# Altium schematic sheet Sheet1.SchDoc
size 594 x 420 mm; SheetNumber: 1; SheetTotal: 1
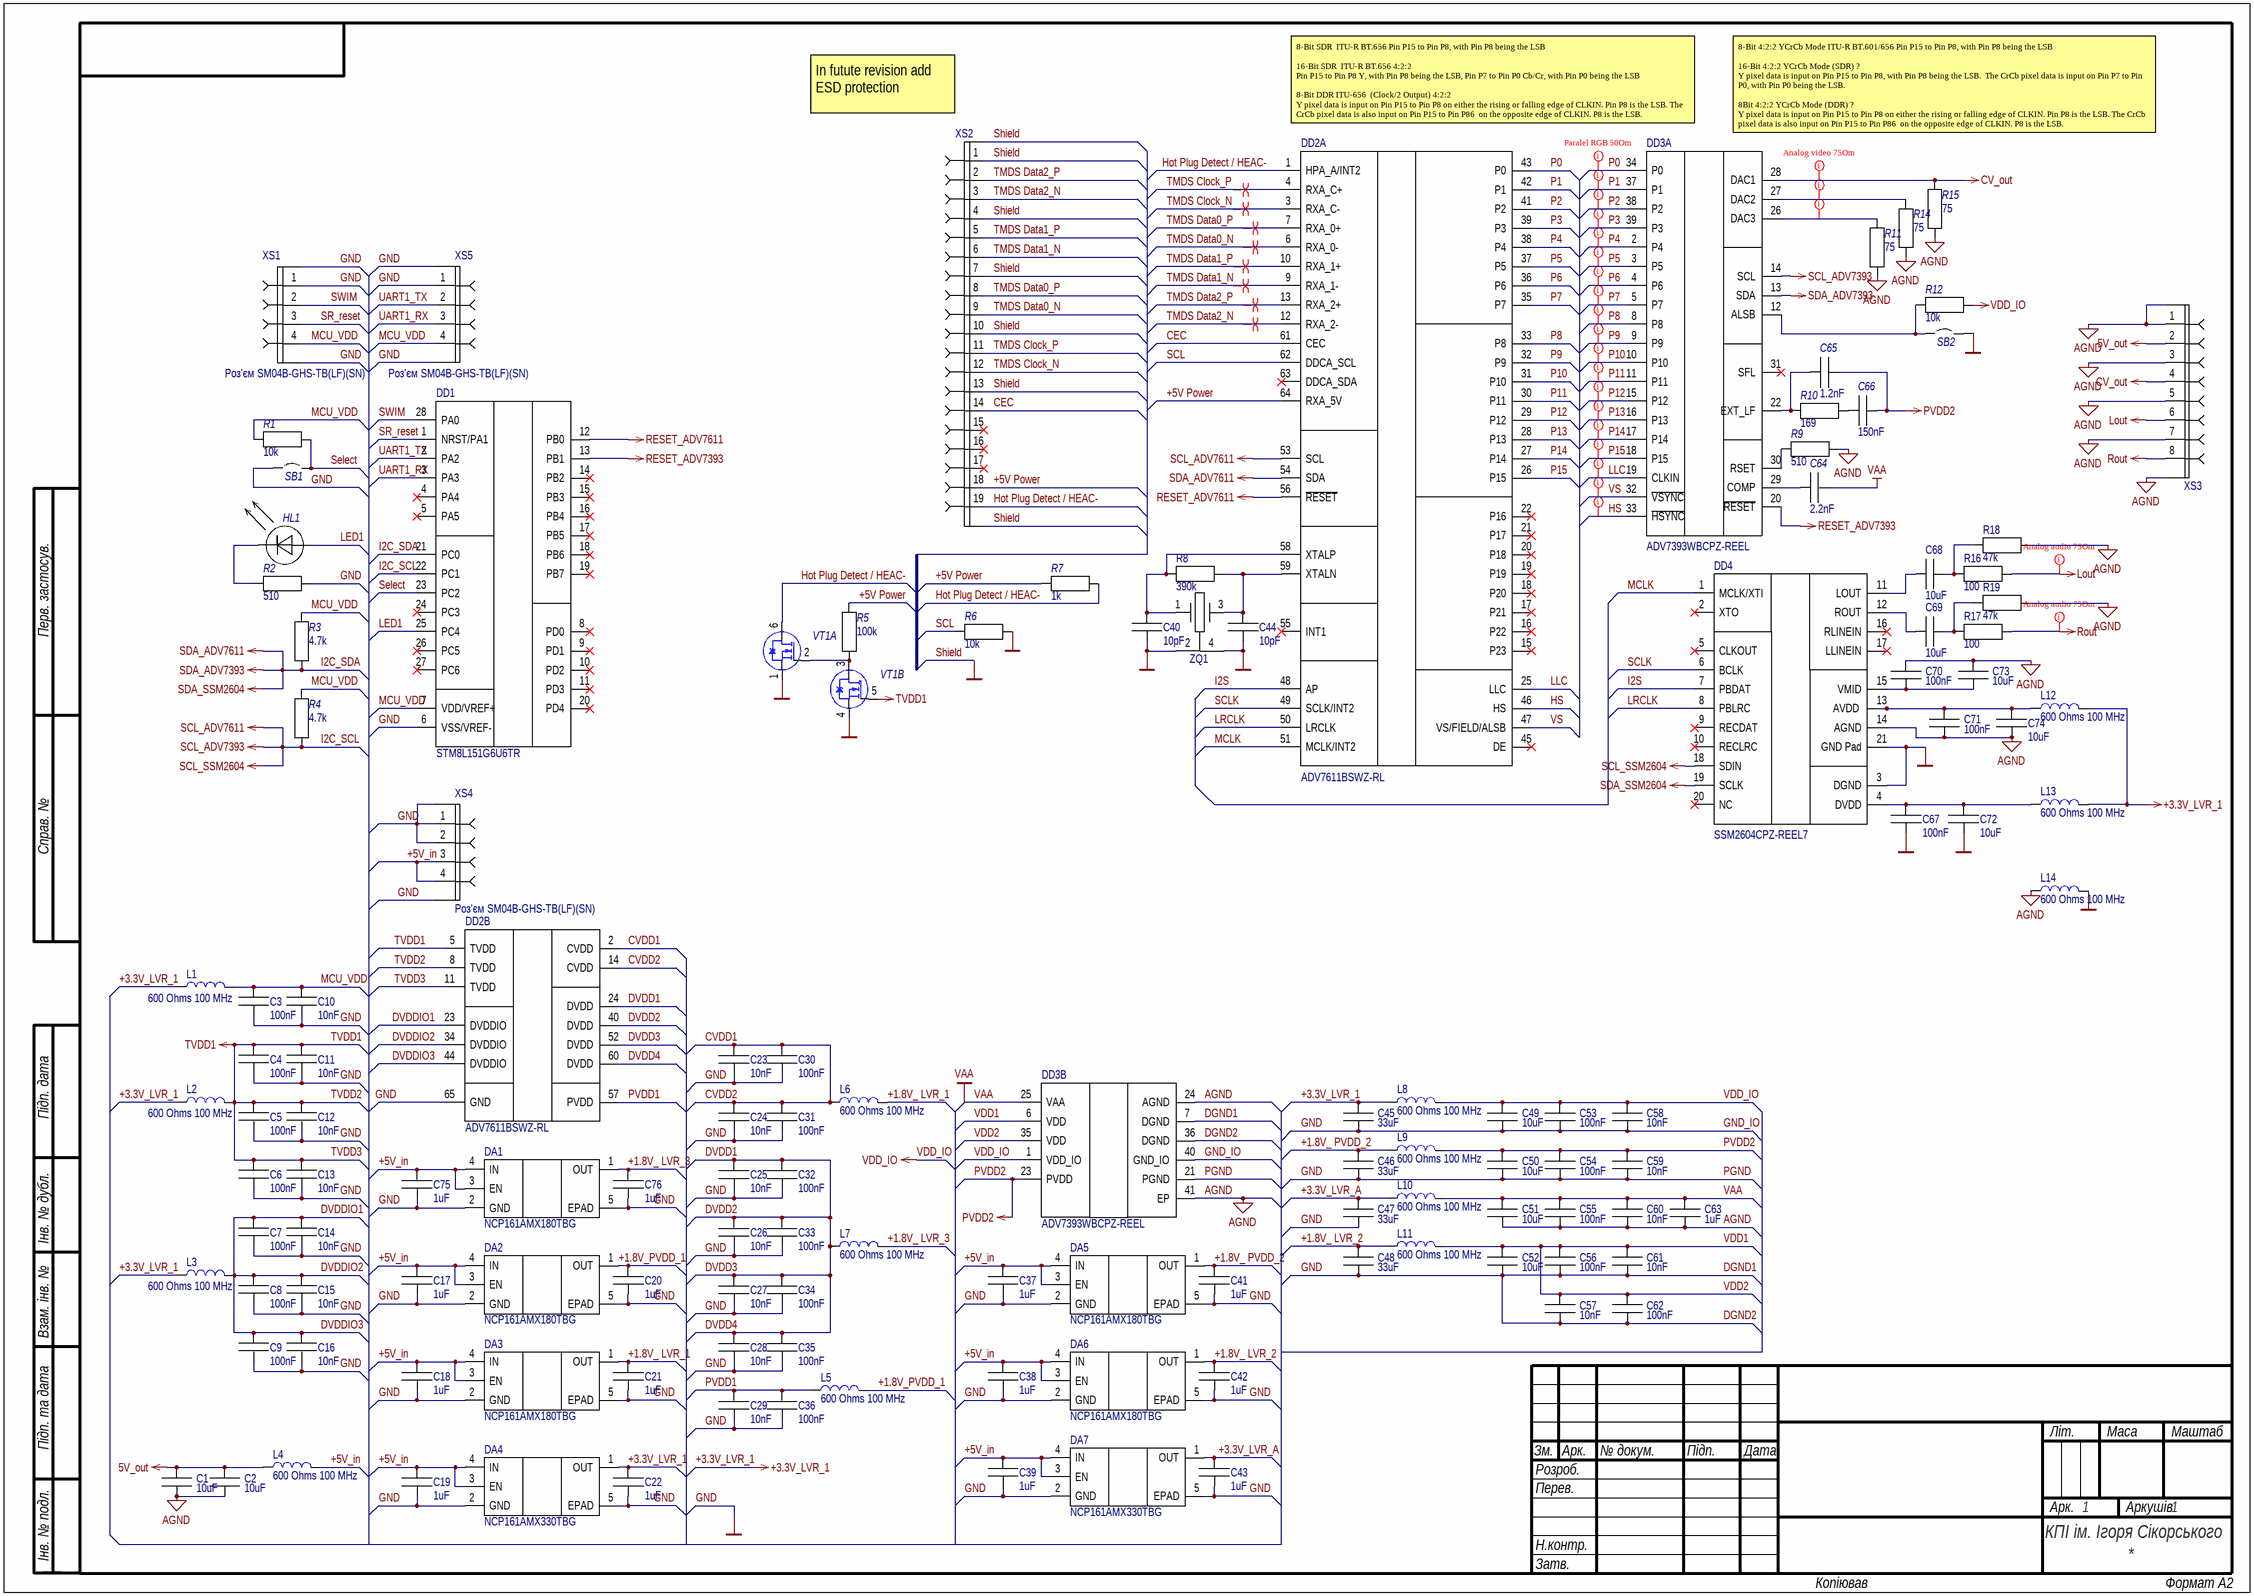
[diagram p0: Sheet1.SchDoc]

## Parts
C1  value 10uF  [SC0603_L]  (hidden comment: CL10A106MQ8NNNC)
C2  value 10uF  [SC0603_L]  (hidden comment: CL10A106MQ8NNNC)
C3  value 100nF  [FP-C0402-BB-IPC_A]  (hidden comment: C0402C104K4RAC7867)
C4  value 100nF  [FP-C0402-BB-IPC_A]  (hidden comment: C0402C104K4RAC7867)
C5  value 100nF  [FP-C0402-BB-IPC_A]  (hidden comment: C0402C104K4RAC7867)
C6  value 100nF  [FP-C0402-BB-IPC_A]  (hidden comment: C0402C104K4RAC7867)
C7  value 100nF  [FP-C0402-BB-IPC_A]  (hidden comment: C0402C104K4RAC7867)
C8  value 100nF  [FP-C0402-BB-IPC_A]  (hidden comment: C0402C104K4RAC7867)
C9  value 100nF  [FP-C0402-BB-IPC_A]  (hidden comment: C0402C104K4RAC7867)
C10  value 10nF  [FP-C0402-BB-IPC_A]  (hidden comment: C0402C103K4RAC7867)
C11  value 10nF  [FP-C0402-BB-IPC_A]  (hidden comment: C0402C103K4RAC7867)
C12  value 10nF  [FP-C0402-BB-IPC_A]  (hidden comment: C0402C103K4RAC7867)
C13  value 10nF  [FP-C0402-BB-IPC_A]  (hidden comment: C0402C103K4RAC7867)
C14  value 10nF  [FP-C0402-BB-IPC_A]  (hidden comment: C0402C103K4RAC7867)
C15  value 10nF  [FP-C0402-BB-IPC_A]  (hidden comment: C0402C103K4RAC7867)
C16  value 10nF  [FP-C0402-BB-IPC_A]  (hidden comment: C0402C103K4RAC7867)
C17  value 1uF  [SC0603_L]  (hidden comment: CC0603KRX5R8BB105)
C18  value 1uF  [SC0603_L]  (hidden comment: CC0603KRX5R8BB105)
C19  value 1uF  [SC0603_L]  (hidden comment: CC0603KRX5R8BB105)
C20  value 1uF  [SC0603_L]  (hidden comment: CC0603KRX5R8BB105)
C21  value 1uF  [SC0603_L]  (hidden comment: CC0603KRX5R8BB105)
C22  value 1uF  [SC0603_L]  (hidden comment: CC0603KRX5R8BB105)
C23  value 10nF  [FP-C0402-BB-IPC_A]  (hidden comment: C0402C103K4RAC7867)
C24  value 10nF  [FP-C0402-BB-IPC_A]  (hidden comment: C0402C103K4RAC7867)
C25  value 10nF  [FP-C0402-BB-IPC_A]  (hidden comment: C0402C103K4RAC7867)
C26  value 10nF  [FP-C0402-BB-IPC_A]  (hidden comment: C0402C103K4RAC7867)
C27  value 10nF  [FP-C0402-BB-IPC_A]  (hidden comment: C0402C103K4RAC7867)
C28  value 10nF  [FP-C0402-BB-IPC_A]  (hidden comment: C0402C103K4RAC7867)
C29  value 10nF  [FP-C0402-BB-IPC_A]  (hidden comment: C0402C103K4RAC7867)
C30  value 100nF  [FP-C0402-BB-IPC_A]  (hidden comment: C0402C104K4RAC7867)
C31  value 100nF  [FP-C0402-BB-IPC_A]  (hidden comment: C0402C104K4RAC7867)
C32  value 100nF  [FP-C0402-BB-IPC_A]  (hidden comment: C0402C104K4RAC7867)
C33  value 100nF  [FP-C0402-BB-IPC_A]  (hidden comment: C0402C104K4RAC7867)
C34  value 100nF  [FP-C0402-BB-IPC_A]  (hidden comment: C0402C104K4RAC7867)
C35  value 100nF  [FP-C0402-BB-IPC_A]  (hidden comment: C0402C104K4RAC7867)
C36  value 100nF  [FP-C0402-BB-IPC_A]  (hidden comment: C0402C104K4RAC7867)
C37  value 1uF  [SC0603_L]  (hidden comment: CC0603KRX5R8BB105)
C38  value 1uF  [SC0603_L]  (hidden comment: CC0603KRX5R8BB105)
C39  value 1uF  [SC0603_L]  (hidden comment: CC0603KRX5R8BB105)
C40  value 10pF  [SC0603_L]  (hidden comment: C0603-10pF-16V-C0603C100F4HAC7867)
C41  value 1uF  [SC0603_L]  (hidden comment: CC0603KRX5R8BB105)
C42  value 1uF  [SC0603_L]  (hidden comment: CC0603KRX5R8BB105)
C43  value 1uF  [SC0603_L]  (hidden comment: CC0603KRX5R8BB105)
C44  value 10pF  [SC0603_L]  (hidden comment: C0603-10pF-16V-C0603C100F4HAC7867)
C45  value 33uF  [1206]  (hidden comment: C3216X5R1E336M160AC)
C46  value 33uF  [1206]  (hidden comment: C3216X5R1E336M160AC)
C47  value 33uF  [1206]  (hidden comment: C3216X5R1E336M160AC)
C48  value 33uF  [1206]  (hidden comment: C3216X5R1E336M160AC)
C49  value 10uF  [SC0603_L]  (hidden comment: CL10A106MQ8NNNC)
C50  value 10uF  [SC0603_L]  (hidden comment: CL10A106MQ8NNNC)
C51  value 10uF  [SC0603_L]  (hidden comment: CL10A106MQ8NNNC)
C52  value 10uF  [SC0603_L]  (hidden comment: CL10A106MQ8NNNC)
C53  value 100nF  [FP-C0402-BB-IPC_A]  (hidden comment: C0402C104K4RAC7867)
C54  value 100nF  [FP-C0402-BB-IPC_A]  (hidden comment: C0402C104K4RAC7867)
C55  value 100nF  [FP-C0402-BB-IPC_A]  (hidden comment: C0402C104K4RAC7867)
C56  value 100nF  [FP-C0402-BB-IPC_A]  (hidden comment: C0402C104K4RAC7867)
C57  value 10nF  [FP-C0402-BB-IPC_A]  (hidden comment: C0402C103K4RAC7867)
C58  value 10nF  [FP-C0402-BB-IPC_A]  (hidden comment: C0402C103K4RAC7867)
C59  value 10nF  [FP-C0402-BB-IPC_A]  (hidden comment: C0402C103K4RAC7867)
C60  value 10nF  [FP-C0402-BB-IPC_A]  (hidden comment: C0402C103K4RAC7867)
C61  value 10nF  [FP-C0402-BB-IPC_A]  (hidden comment: C0402C103K4RAC7867)
C62  value 100nF  [FP-C0402-BB-IPC_A]  (hidden comment: C0402C104K4RAC7867)
C63  value 1uF  [SC0603_L]  (hidden comment: CC0603KRX5R8BB105)
C64  value 2.2nF  [FP-C0402-BB-IPC_A]  (hidden comment: C0402C222K3RAC7867)
C65  value 1.2nF  [FP-C0402-BB-IPC_A]  (hidden comment: C0402C222K3RAC7867)
C66  value 150nF  [FP-C0402-BB-IPC_A]  (hidden comment: CGA2B1X7R1V154K050BC)
C67  value 100nF  [FP-C0402-BB-IPC_A]  (hidden comment: C0402C104K4RAC7867)
C68  value 10uF  [SC0603_L]  (hidden comment: CL10A106MQ8NNNC)
C69  value 10uF  [SC0603_L]  (hidden comment: CL10A106MQ8NNNC)
C70  value 100nF  [FP-C0402-BB-IPC_A]  (hidden comment: C0402C104K4RAC7867)
C71  value 100nF  [FP-C0402-BB-IPC_A]  (hidden comment: C0402C104K4RAC7867)
C72  value 10uF  [SC0603_L]  (hidden comment: CL10A106MQ8NNNC)
C73  value 10uF  [SC0603_L]  (hidden comment: CL10A106MQ8NNNC)
C74  value 10uF  [SC0603_L]  (hidden comment: CL10A106MQ8NNNC)
C75  value 1uF  [SC0603_L]  (hidden comment: CC0603KRX5R8BB105)
C76  value 1uF  [SC0603_L]  (hidden comment: CC0603KRX5R8BB105)
DA1  NCP161AMX180TBG  [XDFN4_711AJ_ONS_OSI]
DA2  NCP161AMX180TBG  [XDFN4_711AJ_ONS_OSI]
DA3  NCP161AMX180TBG  [XDFN4_711AJ_ONS_OSI]
DA4  NCP161AMX330TBG  [XDFN4_711AJ_ONS_OSI]
DA5  NCP161AMX180TBG  [XDFN4_711AJ_ONS_OSI]
DA6  NCP161AMX180TBG  [XDFN4_711AJ_ONS_OSI]
DA7  NCP161AMX330TBG  [XDFN4_711AJ_ONS_OSI]
DD1  STM8L151G6U6TR  [UFQFPN28-4x4mm]
DD2  ADV7611BSWZ-RL  [ADI-SW-64-2_N]  (parts A,B of 2)
DD3  ADV7393WBCPZ-REEL  [ADI-CP-40-1_N]  (parts A,B of 2)
DD4  SSM2604CPZ-REEL7  [CP_20_4_ADI]
HL1  LTST-C170GKT  [LED_0805_G]  (value not drawn)
L1  value 600 Ohms 100 MHz  [SC0603_L]  (hidden comment: ferrite bead)
L2  value 600 Ohms 100 MHz  [SC0603_L]  (hidden comment: ferrite bead)
L3  value 600 Ohms 100 MHz  [SC0603_L]  (hidden comment: ferrite bead)
L4  value 600 Ohms 100 MHz  [SC0603_L]  (hidden comment: ferrite bead)
L5  value 600 Ohms 100 MHz  [SC0603_L]  (hidden comment: ferrite bead)
L6  value 600 Ohms 100 MHz  [SC0603_L]  (hidden comment: ferrite bead)
L7  value 600 Ohms 100 MHz  [SC0603_L]  (hidden comment: ferrite bead)
L8  value 600 Ohms 100 MHz  [SC0603_L]  (hidden comment: ferrite bead)
L9  value 600 Ohms 100 MHz  [SC0603_L]  (hidden comment: ferrite bead)
L10  value 600 Ohms 100 MHz  [SC0603_L]  (hidden comment: ferrite bead)
L11  value 600 Ohms 100 MHz  [SC0603_L]  (hidden comment: ferrite bead)
L12  value 600 Ohms 100 MHz  [SC0603_L]  (hidden comment: ferrite bead)
L13  value 600 Ohms 100 MHz  [SC0603_L]  (hidden comment: ferrite bead)
L14  value 600 Ohms 100 MHz  [SC0603_L]  (hidden comment: ferrite bead)
R1  value 10k  [RC04025-L]  (hidden comment: ERJ-2RKF1002X)
R2  value 510  [RC04025-L]  (hidden comment: ERJ-2RKF5100X)
R3  value 4.7k  [RC04025-L]  (hidden comment: ERJ-2RKF4701X)
R4  value 4.7k  [RC04025-L]  (hidden comment: ERJ-2RKF4701X)
R5  value 100k  [RC04025-L]  (hidden comment: ERJ-2RKF1003X)
R6  value 10k  [RC04025-L]  (hidden comment: ERJ-2RKF1002X)
R7  value 1k  [RC04025-L]  (hidden comment: ERJ-2RKF1001X)
R8  value 390k  [RC04025-L]  (hidden comment: RK73H1ETTP3903F)
R9  value 510  [RC04025-L]  (hidden comment: ERJ-2RKF5100X)
R10  value 169  [RC04025-L]  (hidden comment: ERJ-2RKF1690X)
R11  value 75  [RC04025-L]  (hidden comment: ERJ-2GEJ750X)
R12  value 10k  [RC04025-L]  (hidden comment: ERJ-2RKF1002X)
R14  value 75  [RC04025-L]  (hidden comment: ERJ-2GEJ750X)
R15  value 75  [RC04025-L]  (hidden comment: ERJ-2GEJ750X)
R16  value 100  [RC04025-L]  (hidden comment: ERJ-2RKF1000X)
R17  value 100  [RC04025-L]  (hidden comment: ERJ-2RKF1000X)
R18  value 47k  [RC04025-L]  (hidden comment: ERJ-2RKF4702X)
R19  value 47k  [RC04025-L]  (hidden comment: ERJ-2RKF4702X)
SB1  Jumper SB  [SB0603]  (value not drawn)  (no BOM)
SB2  Jumper SB  [SB0603]  (value not drawn)  (no BOM)
VT1  FDY3000NZ  [FAIR-SOT-563F-6-A_V]  (value not drawn)  (parts A,B of 2)
XS1  Назва за КД: Роз'єм SM04B-GHS-TB(LF)(SN)  [SM04B-GHS-TB]  (hidden comment: SM04B-GHS-TB)
XS2  685119136923  [685119136923]  (value not drawn)
XS3  SM08B-GHS-TB  [SM08B-GHS-TB]  (value not drawn)
XS4  Назва за КД: Роз'єм SM04B-GHS-TB(LF)(SN)  [SM04B-GHS-TB]  (hidden comment: SM04B-GHS-TB)
XS5  Назва за КД: Роз'єм SM04B-GHS-TB(LF)(SN)  [SM04B-GHS-TB]  (hidden comment: SM04B-GHS-TB)
ZQ1  ABM11-28.63636MHZ-D2X-T3  [FP-ABM11-MFG]  (value not drawn)

## Nets
5V_out: C1.2 C2.2 L4.1 XS3.2
+3.3V_LVR_1: C22.2 C45.2 DA4.1(OUT) L1.1 L2.1 L3.1 L8.1 L12.2 L13.2
AGND: C1.1 C2.1 C51.1 C55.1 C60.1 C63.1 C70.2 C71.1 C73.2 C74.1 DD3.24(AGND) DD3.41(EP) DD4.14(AGND) L14.1 R9.2 R11.1 R14.1 R15.1 R18.1 R19.1 XS3.1 XS3.3 XS3.5 XS3.7 XS3.M
CV_out: DD3.28(DAC1) R15.2 XS3.4
DGND1: C3.1 C4.1 C5.1 C6.1 C7.1 C8.1 C9.1 C10.1 C11.1 C12.1 C13.1 C14.1 C15.1 C16.1 C17.1 C18.1 C19.1 C20.1 C21.1 C22.1 C23.1 C24.1 C25.1 C26.1 C27.1 C28.1 C29.1 C30.1 C31.1 C32.1 C33.1 C34.1 C35.1 C36.1 C37.1 C38.1 C39.1 C40.1 C41.1 C42.1 C43.1 C44.1 C45.1 C46.1 C47.1 C48.1 C49.1 C50.1 C52.1 C53.1 C54.1 C56.1 C57.1 C58.1 C59.1 C61.1 C62.1 C67.1 C72.1 C75.1 C76.1 DA1.2(GND) DA1.5(EPAD) DA2.2(GND) DA2.5(EPAD) DA3.2(GND) DA3.5(EPAD) DA4.2(GND) DA4.5(EPAD) DA5.2(GND) DA5.5(EPAD) DA6.2(GND) DA6.5(EPAD) DA7.2(GND) DA7.5(EPAD) DD1.6(VSS/VREF-) DD2.65(GND) DD3.7(DGND) DD3.21(PGND) DD3.36(DGND) DD3.40(GND_IO) DD4.3(DGND) DD4.21(GND_Pad) L14.2 R2.2 R6.1 SB1.1 SB2.1 VT1.1(S1) VT1.4(S2) XS1.1 XS1.M XS2.1(TMDS_Data2_Shield) XS2.4(TMDS_Data1_Shield) XS2.7(TMDS_Data0_Shield) XS2.10(TMDS_Clock_Shield) XS2.13(DDC_/_CEC_Ground_/_HEAC_Shield) XS2.Shell(Shield) XS4.1 XS4.2 XS4.M XS5.1 XS5.M ZQ1.2(GND) ZQ1.4(GND)  [also labelled DGND2, GND, GND_IO, PGND, Shield]
I2C_SCL: DD1.22(PC1) DD2.53(SCL) DD3.14(SCL) DD4.18(SDIN) R4.1  [also labelled SCL_ADV7393, SCL_ADV7611, SCL_SSM2604]
I2C_SDA: DD1.21(PC0) DD2.54(SDA) DD3.13(SDA) DD4.19(SCLK) R3.1  [also labelled SDA_ADV7393, SDA_ADV7611, SDA_SSM2604]
Lout: R16.2 XS3.6
PVDD2: C50.2 C54.2 C59.2 C65.2 C66.2 DD3.23(PVDD) L9.2
RESET_ADV7393: DD1.13(PB1) DD3.20(~{RESET})
RESET_ADV7611: DD1.12(PB0) DD2.56(~{RESET})
Rout: R17.2 XS3.8
TVDD1: C4.2 C5.2 C6.2 C11.2 C12.2 C13.2 DD2.5(TVDD) DD2.8(TVDD) DD2.11(TVDD) L2.2 VT1.5(G2)  [also labelled TVDD2, TVDD3]
VAA: C51.2 C55.2 C60.2 C63.2 C64.1 DD3.25(VAA) L10.2
VDD_IO: C49.2 C53.2 C58.2 DD3.1(VDD_IO) L8.2 R12.1
+1.8V_ LVR_1: C21.2 DA3.1(OUT) L6.2
+1.8V_ LVR_2: C42.2 C48.2 DA6.1(OUT) L11.1
+1.8V_ LVR_3: C76.2 DA1.1(OUT) L7.2
+1.8V_ PVDD_2: C41.2 C46.2 DA5.1(OUT) L9.1
+1.8V_PVDD_1: C20.2 DA2.1(OUT) L5.2
+3.3V_LVR_A: C43.2 C47.2 DA7.1(OUT) L10.1
+5V Power: DD2.64(RXA_5V) R5.2 R7.1 XS2.18(+5V_Power)
+5V_in: C17.2 C18.2 C19.2 C37.2 C38.2 C39.2 C75.2 DA1.3(EN) DA1.4(IN) DA2.3(EN) DA2.4(IN) DA3.3(EN) DA3.4(IN) DA4.3(EN) DA4.4(IN) DA5.3(EN) DA5.4(IN) DA6.3(EN) DA6.4(IN) DA7.3(EN) DA7.4(IN) L4.2 XS4.3 XS4.4
CEC: DD2.61(CEC) XS2.14(CEC)
CVDD1: C23.2 C24.2 C30.2 C31.2 DD2.2(CVDD) DD2.14(CVDD) L6.1  [also labelled CVDD2]
DVDD1: C25.2 C26.2 C27.2 C28.2 C32.2 C33.2 C34.2 C35.2 DD2.24(DVDD) DD2.40(DVDD) DD2.52(DVDD) DD2.60(DVDD) L7.1  [also labelled DVDD2, DVDD3, DVDD4]
DVDDIO1: C7.2 C8.2 C9.2 C14.2 C15.2 C16.2 DD2.23(DVDDIO) DD2.34(DVDDIO) DD2.44(DVDDIO) L3.2  [also labelled DVDDIO2, DVDDIO3]
Hot Plug Detect / HEAC-: DD2.1(HPA_A/INT2) R7.2 VT1.6(D1) XS2.19(Hot_Plug_Detect_/_HEAC-)
HS: DD2.46(HS) DD3.33(~{HSYNC})
I2S: DD2.48(AP) DD4.7(PBDAT)
LED1: DD1.25(PC4) HL1.2(A)
LLC: DD2.25(LLC) DD3.19(CLKIN)
LRCLK: DD2.50(LRCLK) DD4.8(PBLRC)
MCLK: DD2.51(MCLK/INT2) DD4.1(MCLK/XTI)
MCU_VDD: C3.2 C10.2 DD1.7(VDD/VREF+) L1.2 R1.1 R3.2 R4.2 XS1.4 XS5.4
P0: DD2.43(P0) DD3.34(P0)
P1: DD2.42(P1) DD3.37(P1)
P2: DD2.41(P2) DD3.38(P2)
P3: DD2.39(P3) DD3.39(P3)
P4: DD2.38(P4) DD3.2(P4)
P5: DD2.37(P5) DD3.3(P5)
P6: DD2.36(P6) DD3.4(P6)
P7: DD2.35(P7) DD3.5(P7)
P8: DD2.33(P8) DD3.8(P8)
P9: DD2.32(P9) DD3.9(P9)
P10: DD2.31(P10) DD3.10(P10)
P11: DD2.30(P11) DD3.11(P11)
P12: DD2.29(P12) DD3.15(P12)
P13: DD2.28(P13) DD3.16(P13)
P14: DD2.27(P14) DD3.17(P14)
P15: DD2.26(P15) DD3.18(P15)
PVDD1: C29.2 C36.2 DD2.57(PVDD) L5.1
SCL: DD2.62(DDCA_SCL) R6.2
SCLK: DD2.49(SCLK/INT2) DD4.6(BCLK)
Select: DD1.23(PC2) R1.2 SB1.2
SR_reset: DD1.1(NRST/PA1) XS1.3
SWIM: DD1.28(PA0) XS1.2
TMDS Clock_N: DD2.3(RXA_C-) XS2.12(TMDS_Clock-)
TMDS Clock_P: DD2.4(RXA_C+) XS2.11(TMDS_Clock+)
TMDS Data0_N: DD2.6(RXA_0-) XS2.9(TMDS_Data0-)
TMDS Data0_P: DD2.7(RXA_0+) XS2.8(TMDS_Data0+)
TMDS Data1_N: DD2.9(RXA_1-) XS2.6(TMDS_Data1-)
TMDS Data1_P: DD2.10(RXA_1+) XS2.5(TMDS_Data1+)
TMDS Data2_N: DD2.12(RXA_2-) XS2.3(TMDS_Data2-)
TMDS Data2_P: DD2.13(RXA_2+) XS2.2(TMDS_Data2+)
UART1_RX: DD1.3(PA3) XS5.3
UART1_TX: DD1.2(PA2) XS5.2
VDD1: C52.2 C56.2 C57.2 C61.2 C62.2 DD3.6(VDD) DD3.35(VDD) L11.2  [also labelled VDD2]
VS: DD2.47(VS/FIELD/ALSB) DD3.32(~{VSYNC})
NetC40_2: C40.2 DD2.58(XTALP) R8.1 ZQ1.1(OSC1)
NetC44_2: C44.2 DD2.59(XTALN) R8.2 ZQ1.3(OSC2)
NetC64_2: C64.2 DD3.29(COMP)
NetC65_1: C65.1 DD3.22(EXT_LF) R10.1
NetC66_1: C66.1 R10.2
NetC67_2: C67.2 C72.2 DD4.4(DVDD) L13.1
NetC68_1: C68.1 R16.1 R18.2
NetC68_2: C68.2 DD4.11(LOUT)
NetC69_1: C69.1 R17.1 R19.2
NetC69_2: C69.2 DD4.12(ROUT)
NetC70_1: C70.1 C73.1 DD4.15(VMID)
NetC71_2: C71.2 C74.2 DD4.13(AVDD) L12.1
NetDD3_12: DD3.12(ALSB) R12.2 SB2.2
NetDD3_26: DD3.26(DAC3) R11.2
NetDD3_27: DD3.27(DAC2) R14.2
NetDD3_30: DD3.30(RSET) R9.1
NetHL1_1: HL1.1(K) R2.1
NetR5_1: R5.1 VT1.2(G1) VT1.3(D2)

Not connected (* = marked no-connect by the designer): DD1 4(PA4)* 5(PA5)* 8(PD0)* 9(PD1)* 10(PD2)* 11(PD3)* 14(PB2)* 15(PB3)* 16(PB4)* 17(PB5)* 18(PB6)* 19(PB7)* 20(PD4)* 24(PC3)* 26(PC5)* 27(PC6)*; DD2 15(P23)* 16(P22)* 17(P21)* 18(P20)* 19(P19)* 20(P18)* 21(P17)* 22(P16)* 45(DE)* 55(INT1)* 63(DDCA_SDA)*; DD3 31(SFL)*; DD4 2(XTO)* 5(CLKOUT)* 9(RECDAT)* 10(RECLRC)* 16(RLINEIN)* 17(LLINEIN)* 20(NC)*; XS2 15(SCL)* 16(SDA)* 17(Utility_/_HEAC+)*

## Layout directives
differential pair; differential pair class HDMI: TMDS Clock_N, TMDS Clock_P, TMDS Data0_N, TMDS Data0_P, TMDS Data1_N, TMDS Data1_P, TMDS Data2_N, TMDS Data2_P
net class Paralel RGB: HS, LLC, P0, P1, P2, P3, P4, P5, P6, P7, P8, P9, P10, P11, P12, P13, P14, P15, VS
net class Analog video 75Om: CV_out, Lout, NetDD3_26, NetDD3_27, Rout

## Notes on the sheet
- (near XS2) In futute revision add ESD protection
- 8-Bit SDR  ITU-R BT.656 Pin P15 to Pin P8, with Pin P8 being the LSB
  16-Bit SDR  ITU-R BT.656 4:2:2
  Pin P15 to Pin P8 Y, with Pin P8 being the LSB, Pin P7 to Pin P0 Cb/Cr, with Pin P0 being the LSB
  8-Bit DDR ITU-656  (Clock/2 Output) 4:2:2
  Y pixel data is input on Pin P15 to Pin P8 on either the rising or falling edge of CLKIN. Pin P8 is the LSB. The CrCb pixel data is also input on Pin P15 to Pin P86  on the opposite edge of CLKIN. P8 is the LSB.
- 8-Bit 4:2:2 YCrCb Mode ITU-R BT.601/656 Pin P15 to Pin P8, with Pin P8 being the LSB
  16-Bit 4:2:2 YCrCb Mode (SDR) ?
  Y pixel data is input on Pin P15 to Pin P8, with Pin P8 being the LSB.  The CrCb pixel data is input on Pin P7 to Pin P0, with Pin P0 being the LSB.
  8Bit 4:2:2 YCrCb Mode (DDR) ?
  Y pixel data is input on Pin P15 to Pin P8 on either the rising or falling edge of CLKIN. Pin P8 is the LSB. The CrCb pixel data is also input on Pin P15 to Pin P86  on the opposite edge of CLKIN. P8 is the LSB.
- Перв. застосув.
- Справ. №
- Підп. дата
- Інв. № дубл.
- Взам. інв. №
- Підп. та дата
- Зм.
- Розроб.
- Арк.
- № докум.
- Підп.
- Дата
- Літ.
- Маса
- Маштаб
- Перев.
- Аркушів
- Інв. № подл.
- Н.контр.
- Затв.
- КПІ ім. Ігоря Сікорського
- ALTIUM GOSTBOM2.0 KEV
- Копіював
- Формат А2

## Library data of the parts
C1 C2 C49-C52 C68 C69 C72-C74 = C0603-10µF-6.3V-10CL10A106MQ8NNNC: 10 µF ±20% 6.3V Ceramic Capacitor X5R 0603 (1608 Metric); Назва за КД: Конденсатор CL10A106MQ8NNNC; Supplier link 1: https://www.digikey.com/en/products/detail/samsung-electro-mechanics/CL10A106MQ8NNNC/3886777?s=N4IgTCBcDaIMIBkCMAGAgqgbAWQIoA4A5YuEAXQF8g; Supplier link 2: https://www.mouser.com/ProductDetail/Samsung-Electro-Mechanics/CL10A106MQ8NNNC?qs=349EhDEZ59qlB6a%2FjjeGAg%3D%3D
C3-C9 C30-C36 C53-C56 C62 C67 C70 C71 = C0402-100nF-16V-C0402C104K4RAC7867: 0.1 µF ±10% 16V Ceramic Capacitor X7R 0402 (1005 Metric); Назва за КД: Конденсатор C0402C104K4RAC7867; Supplier link 1: https://www.digikey.com/en/products/detail/kemet/C0402C104K4RAC7867/789653
C10-C16 C23-C29 C57-C61 = C0402-10nF-16V-C0402C103K4RAC7867: 10000 pF ±10% 16V Ceramic Capacitor X7R 0402 (1005 Metric); Назва за КД: Конденсатор C0402C103K4RAC7867; Supplier link 1: https://www.digikey.com/en/products/detail/kemet/C0402C103K4RAC7867/411040
C17-C22 C37-C39 C41-C43 C63 C75 C76 = C0603-1µF-25V-CC0603KRX5R8BB105: 1 µF ±10% 25V Ceramic Capacitor X5R 0603 (1608 Metric); Назва за КД: Конденсатор CC0603KRX5R8BB105; Supplier link 1: https://www.digikey.com/en/products/detail/yageo/CC0603KRX5R8BB105/2833610?s=N4IgTCBcDaIMJwAwDZEGYDSAlAGgViwA4AhYgRkTxAF0BfIA; Supplier link 2: https://www.mouser.com/ProductDetail/YAGEO/CC0603KRX5R8BB105?qs=BKNoF%2F0xMNuZVooGAHMQbg%3D%3D
C40 C44 = C0603-10pF-16V-C0603C100F4HAC7867: 10 pF ±1% 16V Ceramic Capacitor X8R 0603 (1608 Metric); Назва за КД: Конденсатор C0603C100F4HAC7867; Supplier link 1: https://www.digikey.com/en/products/detail/kemet/C0603C100F4HAC7867/7945991
C45-C48 = C1206_33uF_25V_C3216X5R1E336M160AC: 33 µF ±20% 25V Ceramic Capacitor X5R 1206 (3216 Metric); Назва за КД: Конденсатор C3216X5R1E336M160AC; Supplier link 1: https://www.digikey.com/en/products/detail/tdk-corporation/C3216X5R1E336M160AC/2792259; Supplier link 2: *; Supplier link 3: *
C64 = C0402-2.2nF-25V-C0402C222K3RAC7867: 2200 pF ±10% 25V Ceramic Capacitor X7R 0402 (1005 Metric); Назва за КД: Конденсатор C0402C222K3RAC7867; Supplier link 1: https://www.digikey.com/en/products/detail/kemet/C0402C222K3RAC7867/411035
C65 = C0402-1.2nF-50V-C0402C122J5GAC7867: 1200 pF ±5% 50V Ceramic Capacitor C0G, NP0 0402 (1005 Metric); Назва за КД: Конденсатор C0402C222K3RAC7867; Supplier link 1: https://www.digikey.com/en/products/detail/kemet/C0402C122J5GAC7867/3316991
C66 = C0402-150nF-35V-CGA2B1X7R1V154K050BC: 0.15 µF ±10% 35V Ceramic Capacitor X7R 0402 (1005 Metric); Назва за КД: Конденсатор CGA2B1X7R1V154K050BC; Supplier link 1: https://www.digikey.com/en/products/detail/tdk-corporation/CGA2B1X7R1V154K050BC/4931436
DA1-DA3 DA5 DA6 = NCP161AMX180TBG: IC REG LINEAR 1.8V 450MA 4XDFN; Назва за КД: Мікросхема NCP161AMX180TBG; Supplier link 1: https://www.digikey.com/en/products/detail/onsemi/NCP161AMX180TBG/5257724?s=N4IgTCBcDaIHIGEAKBGAbCgggWQBooA4AGAFQCEBxEAXQF8g
DA4 DA7 = NCP161AMX330TBG: IC REG LINEAR 3.3V 450MA 4XDFN; Назва за КД: Мікросхема NCP161AMX330TBG; Supplier link 1: https://www.digikey.com/en/products/detail/onsemi/NCP161AMX330TBG/5257729?s=N4IgTCBcDaIHIGEAKBGAbCgggWQBoGZ8AGAFQCEBxEAXQF8g
DD1 = STM8L151G6U6TR: STM8 STM8L EnergyLite Microcontroller IC 8-Bit 16MHz 32KB (32K x 8) FLASH 28-UFQFPN (4x4); Назва за КД: Мікросхема STM8L151G6U6TR; Supplier link 1: https://www.digikey.com/en/products/detail/stmicroelectronics/STM8L151G6U6TR/2529374; Supplier link 2: *
DD2 = ADV7611BSWZ-RL: Video Receiver IC I2C, I2S HDMI 1.4a, IEC 60958 64-LQFP-EP (10x10) Package; Назва за КД: Мікросхема ADV7611BSWZ-RL; Supplier link 1: https://www.win-source.net/products/detail/analog-devices-inc/adv7611bswz-rl.html; Supplier link 2: https://www.heisener.com/ProductDetail/ADV7611BSWZ-RL; Supplier link 3: https://octopart.com/adv7611bswz-rl-analog+devices-22024330?r=sp
DD3 = ADV7393WBCPZ-REEL: Low Power, Chip Scale, 10-Bit SD/HD Video Encoder, 1.8/3.3 V, 16-bit Video Input Port, -40 to 105 degC, 40-Pin LFCSP (CP-40-1), RoHS, Reel; Назва за КД: Мікросхема ADV7393WBCPZ-REEL; Supplier link 1: https://www.digikey.com/en/products/detail/analog-devices-inc/ADV7393WBCPZ-REEL/6163897; Supplier link 2: *; Supplier link 3: *
DD4 = SSM2604CPZ-REEL7: Stereo Audio Interface 24 b Serial 20-LFCSP (4x4); Назва за КД: Мікросхема SSM2604CPZ-REEL7; Supplier link 1: https://www.digikey.com/en/products/detail/analog-devices-inc/SSM2604CPZ-REEL7/1944265?s=N4IgjCBcoLQExVAYygFwE4FcCmAaEA9lANogCsI%2BAnCALoC%2B%2BMN0IKkGO%2BRkpEDjEAl4gAyqICycAGwAGACx16QA; Supplier link 2: https://eu.mouser.com/ProductDetail/Analog-Devices/SSM2604CPZ-REEL7?qs=WIvQP4zGanjzkHQKJZeKuA%3D%3D&utm_source=octopart&utm_medium=aggregator&utm_campaign=584-SSM2604CPZ-R7&utm_content=Analog+Devices+Inc.
HL1 = LED_0805_LTST-C170GKT: Green 569nm LED Indication - Discrete 2.1V 0805 (2012 Metric); Назва за КД: Світлодіод TJ-S3216SW9TGLC7K-A5; Supplier link 1: https://www.digikey.com/en/products/detail/liteon/LTST-C170GKT/269226
L1-L14 = BBHV00160808601Y00: 600 Ohms @ 100 MHz 1 Ferrite Bead 0603 (1608 Metric) 2A 100mOhm; Supplier link 1: https://www.digikey.com/en/products/detail/pulse-electronics/BBHV00160808601Y00/10508599?_gl=1*r82f7z*_up*MQ..&gclid=Cj0KCQiAnKeCBhDPARIsAFDTLTIWUi_VlukfZKLeJup5zjw6K0pO7YUGtIszURMuY4osn_knpUlntF8aAvaFEALw_wcB
R1 R6 R12 = R0402_10k_ERJ-2RKF1002X: 10 kOhms ±1% 0.1W, 1/10W Chip Resistor 0402 (1005 Metric) Automotive AEC-Q200 Thick Film; Назва за КД: Резистор ERJ-2RKF1002X; Supplier link 1: https://www.digikey.com/en/products/detail/panasonic-electronic-components/ERJ-2RKF1002X/192073; Supplier link 2: *; Supplier link 3: *
R2 R9 = R0402_510_ERJ-2RKF5100X: 510 Ohms ±1% 0.1W, 1/10W Chip Resistor 0402 (1005 Metric) Automotive AEC-Q200 Thick Film; Назва за КД: Резистор ERJ-2RKF5100X; Supplier link 1: https://www.digikey.com/en/products/detail/panasonic-electronic-components/ERJ-2RKF5100X/1746240; Supplier link 2: *; Supplier link 3: *
R3 R4 = R0402_4.7k_ERJ-2RKF4701X: 4.7 kOhms ±1% 0.1W, 1/10W Chip Resistor 0402 (1005 Metric) Automotive AEC-Q200 Thick Film; Назва за КД: Резистор ERJ-2RKF4701X; Supplier link 1: https://www.digikey.com/en/products/detail/panasonic-electronic-components/ERJ-2RKF4701X/1746231?s=N4IgTCBcDaIKICUBSBaMCDSAxALAdgAYBGADRAF0BfIA; Supplier link 2: *; Supplier link 3: *
R5 = R0402_100k_ERJ-2RKF1003X: 100 kOhms ±1% 0.1W, 1/10W Chip Resistor 0402 (1005 Metric) Automotive AEC-Q200 Thick Film; Назва за КД: Резистор ERJ-2RKF1003X; Supplier link 1: https://www.digikey.com/en/products/detail/panasonic-electronic-components/ERJ-2RKF1003X/192081; Supplier link 2: *; Supplier link 3: *
R7 = R0402_1k_ERJ-2RKF1001X: 1 kOhms ±1% 0.1W, 1/10W Chip Resistor 0402 (1005 Metric) Automotive AEC-Q200 Thick Film; Назва за КД: Резистор ERJ-2RKF1001X; Supplier link 1: https://www.digikey.com/en/products/detail/panasonic-electronic-components/ERJ-2RKF1001X/79729; Supplier link 2: *; Supplier link 3: *
R8 = R0402_390k_RK73H1ETTP3903F: 390 kOhms ±1% 0.1W, 1/10W Chip Resistor 0402 (1005 Metric) Automotive AEC-Q200 Thick Film; Назва за КД: Резистор RK73H1ETTP3903F; Supplier link 1: https://www.digikey.com/en/products/detail/koa-speer-electronics-inc/RK73H1ETTP3903F/9844485; Supplier link 2: *; Supplier link 3: *
R10 = R0402_169_ERJ-2RKF1690X: 169 Ohms ±1% 0.1W, 1/10W Chip Resistor 0402 (1005 Metric) Automotive AEC-Q200 Thick Film; Назва за КД: Резистор ERJ-2RKF1690X; Supplier link 1: https://www.digikey.com/en/products/detail/panasonic-electronic-components/ERJ-2RKF1690X/192166; Supplier link 2: *; Supplier link 3: *
R11 R14 R15 = R0402_75_ERJ-2GEJ750X: 75 Ohms ±5% 0.1W, 1/10W Chip Resistor 0402 (1005 Metric) Automotive AEC-Q200 Thick Film; Назва за КД: Резистор ERJ-2GEJ750X; Supplier link 1: https://www.digikey.com/en/products/detail/panasonic-electronic-components/ERJ-2GEJ750X/147072; Supplier link 2: *; Supplier link 3: *
R16 R17 = R0402_100_ERJ-2RKF1000X: 100 Ohms ±1% 0.1W, 1/10W Chip Resistor 0402 (1005 Metric) Automotive AEC-Q200 Thick Film; Назва за КД: Резистор ERJ-2RKF1000X; Supplier link 1: https://www.digikey.com/en/products/detail/panasonic-electronic-components/ERJ-2RKF1000X/192080; Supplier link 2: *; Supplier link 3: *
R18 R19 = R0402_47k_ERJ-2RKF4702X: 47 kOhms ±1% 0.1W, 1/10W Chip Resistor 0402 (1005 Metric) Automotive AEC-Q200 Thick Film; Назва за КД: Резистор ERJ-2RKF4702X; Supplier link 1: https://www.digikey.com/en/products/detail/panasonic-electronic-components/ERJ-2RKF4702X/1746233; Supplier link 2: *; Supplier link 3: *
SB1 SB2 = Jumper Opened: Circuit Breaker Opened , for solder closing
VT1 = FDY3000NZ: Mosfet Array 20V 600mA 446mW Surface Mount SOT-563F; Назва за КД: Транзистор FDY3000NZ; Supplier link 1: https://www.digikey.com/en/products/detail/onsemi/fdy3000nz/1923009; Supplier link 2: *
XS1 XS4 XS5 = JST GH SM04B-GHS-TB: 1.25mm pitch/Disconnectable Crimp style connectors
XS2 = 685119136923: HDMI - Mini Receptacle Connector 19 Position Surface Mount, Right Angle; Through Hole; Назва за КД: Роз'єм 685119136923; Supplier link 1: https://www.digikey.com/en/products/detail/w%C3%BCrth-elektronik/685119136923/2508508; Supplier link 2: *; Supplier link 3: *
XS3 = JST GH SM08B-GHS-TB: 1.25x08 JST GH RA; Назва за КД: Роз'єм SM08B-GHS-TB; Supplier link 1: https://www.digikey.com/en/products/detail/jst-sales-america-inc/SM08B-GHS-TB/807792; Supplier link 2: *; Supplier link 3: *
ZQ1 = ABM11-28.63636MHZ-D2X-T3: 28.63636 MHz ±20ppm Crystal 10pF 100 Ohms 4-SMD, No Lead; Назва за КД: Кварц ABM11-28.63636MHZ-D2X-T3; Supplier link 1: https://www.digikey.com/en/products/detail/abracon-llc/ABM11-28-63636MHZ-D2X-T3/2623744?_gl=1*z1352j*_up*MQ..&gclid=Cj0KCQiAnKeCBhDPARIsAFDTLTIWUi_VlukfZKLeJup5zjw6K0pO7YUGtIszURMuY4osn_knpUlntF8aAvaFEALw_wcB